# EAGLE design Single Cell (EAGLE 6.2)
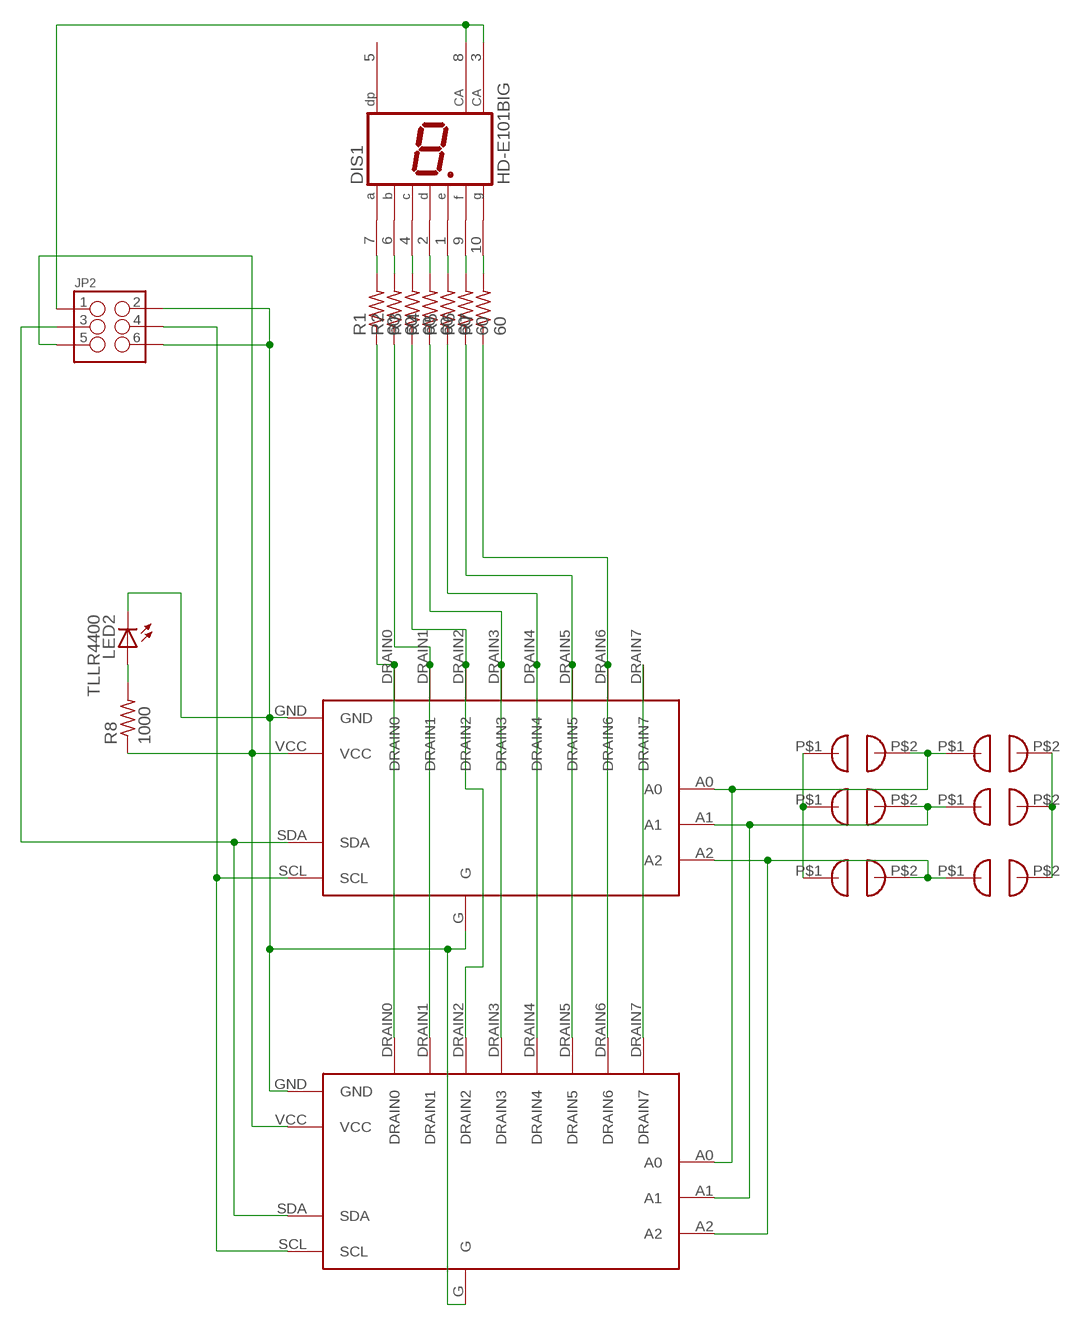
[diagram p0: schematic, sheet 1]

## Parts
DIS1  HD-E101BIG  HD-E101BACKWARDS  [7SEGMENT_BACKWARDS]
JP2  M03X2SHROUD  [2X3-SHROUDED]
LED2  TLLR4400  [LED3MM]
R1  60  R-US_0207/15  [0207/15]
R2  60  R-US_0207/15  [0207/15]
R3  60  R-US_0207/15  [0207/15]
R4  60  R-US_0207/15  [0207/15]
R5  60  R-US_0207/15  [0207/15]
R6  60  R-US_0207/15  [0207/15]
R7  60  R-US_0207/15  [0207/15]
R8  1000  R-US_0207/15  [0207/15]
U$1  SOLDER_JUMPER  [SOLDER_JUMPER]
U$2  LED_DRIVERBOARDADAFRUIT  [DRIVER_BOARD_ADAFRUIT]
U$3  SOLDER_JUMPER  [SOLDER_JUMPER]
U$4  SOLDER_JUMPER  [SOLDER_JUMPER]
U$5  SOLDER_JUMPER  [SOLDER_JUMPER]
U$6  SOLDER_JUMPER  [SOLDER_JUMPER]
U$7  SOLDER_JUMPER  [SOLDER_JUMPER]
U$8  LED_DRIVERBOARD  [DRIVER_BOARD]

## Nets
GND: JP2.2 JP2.6 LED2.K(C) U$1.P$1 U$2.G U$2.GND U$4.P$1 U$6.P$1 U$8.G U$8.GND
N$1: DIS1.7(A) R1.2
N$2: DIS1.6(B) R2.2
N$3: DIS1.4(C) R3.2
N$4: DIS1.2(D) R4.2
N$5: DIS1.1(E) R5.2
N$6: DIS1.9(F) R6.2
N$7: DIS1.10(G) R7.2
N$8: R1.1 U$2.DRAIN0 U$8.DRAIN0
N$9: R2.1 U$2.DRAIN1 U$8.DRAIN1
N$10: R3.1 U$2.DRAIN2 U$8.DRAIN2
N$11: R4.1 U$2.DRAIN3 U$8.DRAIN3
N$12: R5.1 U$2.DRAIN4 U$8.DRAIN4
N$13: R6.1 U$2.DRAIN5 U$8.DRAIN5
N$14: R7.1 U$2.DRAIN6 U$8.DRAIN6
N$15: U$2.A1 U$4.P$2 U$5.P$1 U$8.A1
N$16: U$2.A2 U$6.P$2 U$7.P$1 U$8.A2
N$17: U$2.DRAIN7 U$8.DRAIN7
N$18: LED2.A R8.2
N$29: U$1.P$2 U$2.A0 U$3.P$1 U$8.A0
SDA: JP2.3 U$2.SDA U$8.SDA
SSCL: JP2.4 U$2.SCL U$8.SCL
VCC5: JP2.5 R8.1 U$2.VCC U$3.P$2 U$5.P$2 U$7.P$2 U$8.VCC
VCC12: DIS1.3(CA) DIS1.8(CA) JP2.1
Unconnected: DIS1.5(DP)

## Library data of the parts
DIS1 = Parts:HD-E101: LED DISPLAY 1-character 7 segment, decimal point right
JP2 = Ben-SF-Con:M03X2: 2x3 .1" header. Shrouded, with keying- CONN-10681 SMT- CONN-11415 Pogo pins- HW-11044; PROD_ID: CONN-10681
LED2 = led:TLLR4400: Low Current (2mA) LED 3 mm Tinted Diffused Package color RED Source: Data sheet <http://www.farnell.com/datasheets/391100.pdf>; MF: VISHAY SEMICONDUCTOR; OC_FARNELL: 1612437
R1-R8 = Ben-rcl:R-US_: RESISTOR, American symbol
U$1 U$3-U$7 = Parts:SOLDER_JUMPER
U$2 U$8 = Parts:LED_DRIVERBOARD

## Net classes
0 default: width 0.001 mm

## Board
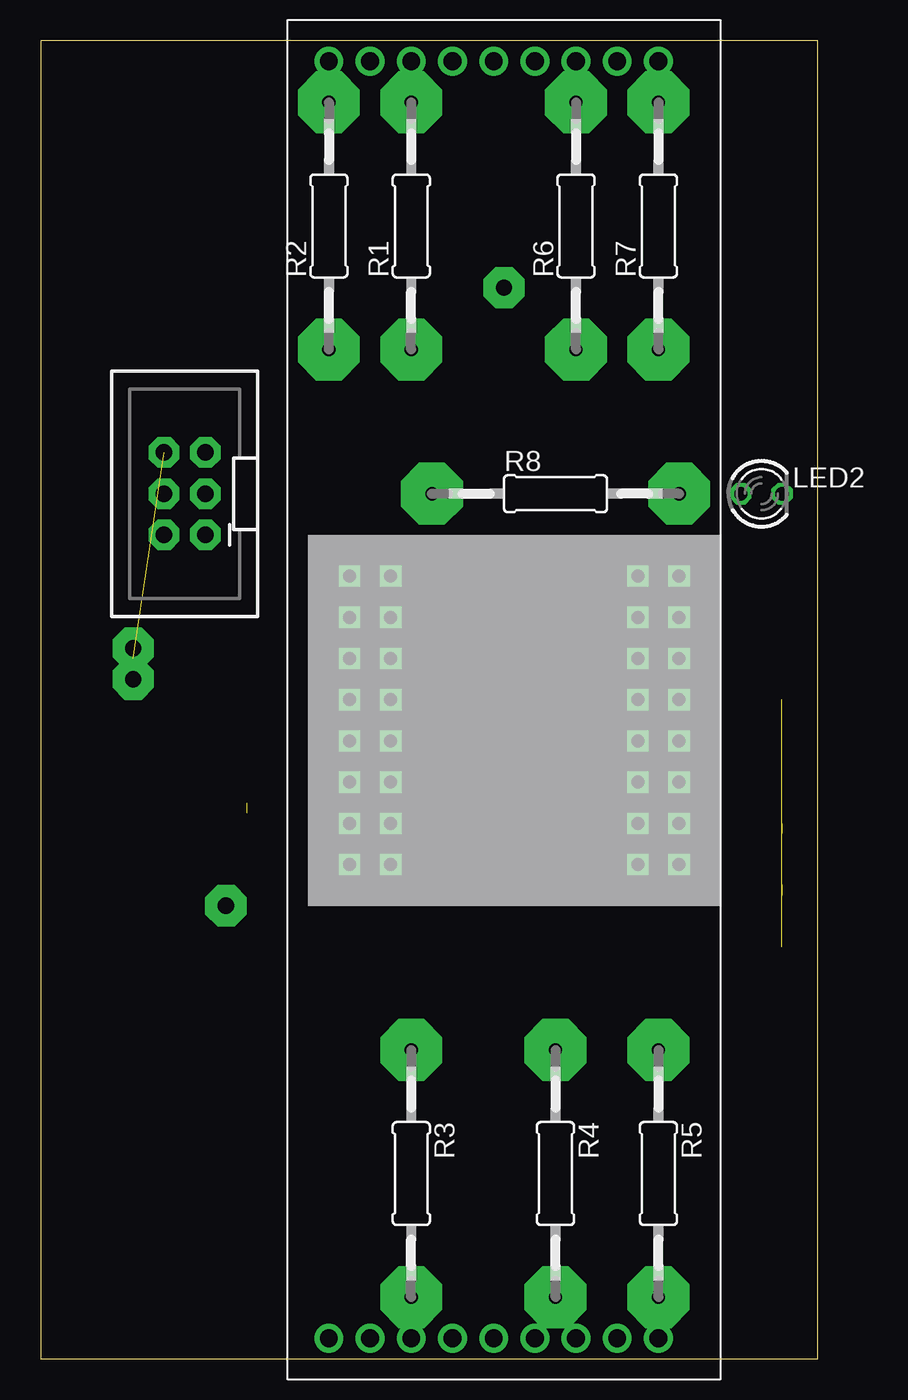
[diagram p1: board, top side]
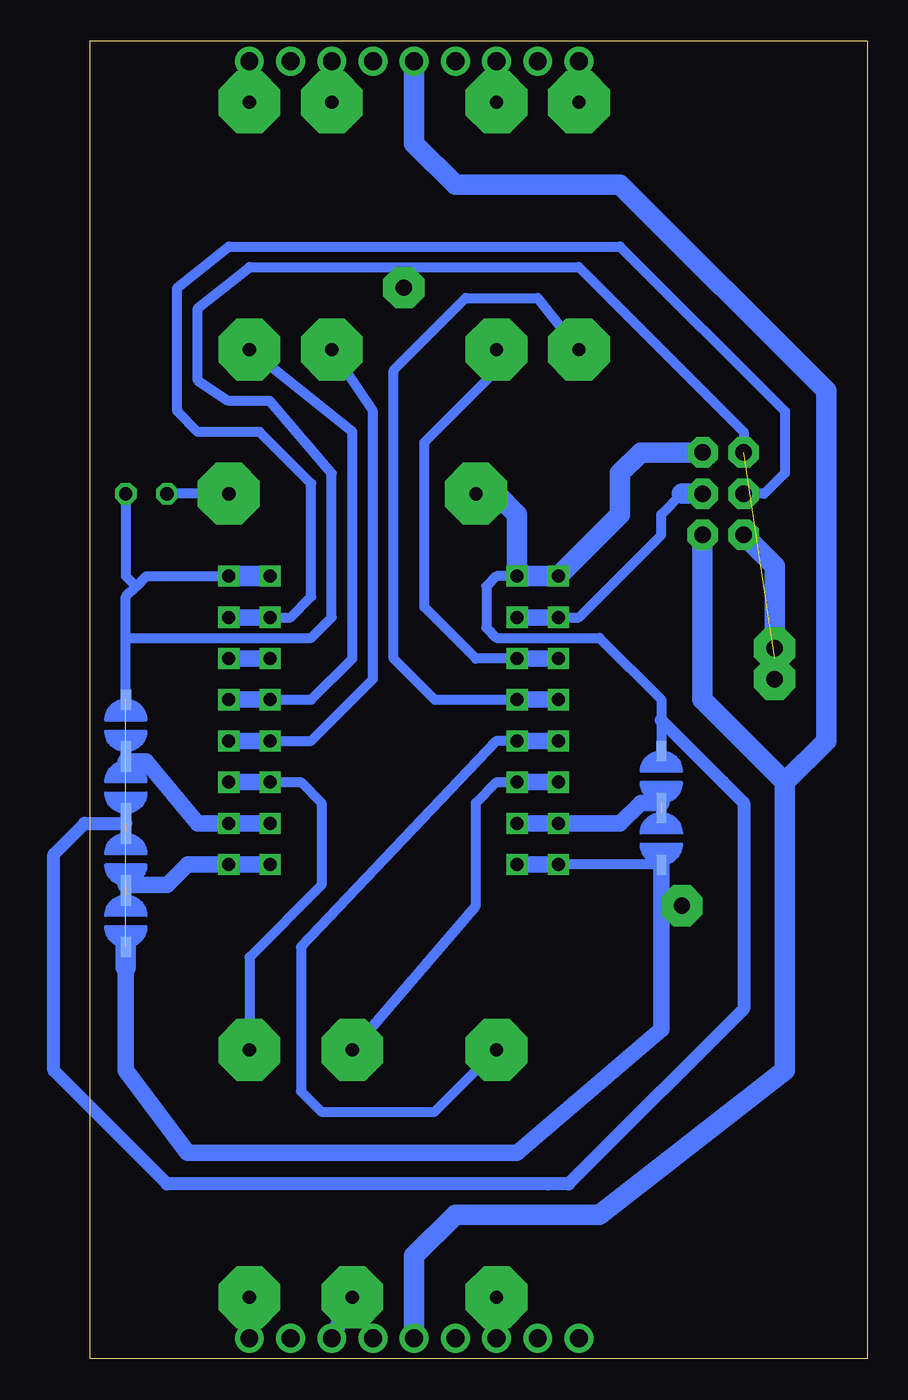
[diagram p2: board, bottom side, seen from below]

Size 47.93 x 81.27 mm. Coordinates in mm from the lower left corner, seen from the top.
Outline: 0,0 47.93,0 47.93,81.27 0,81.27 0,0
Copper layers (1*16): Top 0.035mm / dielectric 1.5mm / Bottom 0.035mm
Design rules: minimum track width 10mil, minimum drill 24mil, track to track 10mil, track to pad 10mil, pad to pad 10mil, via to via 10mil, smd to smd 10mil, copper to edge 40mil, drill to drill 8mil, minimum pad ring 10mil, minimum via ring 8mil, stop-mask expansion 4mil, vias tented up to drill 0mil, thermal gap 10mil

### Footprints (pad centres in the part's own frame; a part is rotated, then mirrored left to right if it is on the bottom)
7SEGMENT_BACKWARDS = drill 1.1 pad 1.778: 1 20.32,0; 2 15.24,0; 3 10.16,0; 4 5.08,0; 5 0,0; 6 0,78.74; 7 5.08,78.74; 8 10.16,78.74; 9 15.24,78.74; 10 20.32,78.74; GND 17.78,78.74; GND2 12.7,78.74; GND3 7.62,78.74; GND4 2.54,78.74; GND5 17.78,0; GND6 12.7,0; GND7 7.62,0; GND8 2.54,0
2X3-SHROUDED = drill 1.016 pad 1.88 octagon: 1 -1.27,2.54; 2 1.27,2.54; 3 -1.27,0; 4 1.27,0; 5 -1.27,-2.54; 6 1.27,-2.54
LED3MM = drill 0.813 octagon: A -1.27,0; K 1.27,0
0207/15 = drill 0.813 pad 3.81 octagon: 1 -7.62,0; 2 7.62,0
SOLDER_JUMPER = smd 0.635 x 1.27: P$1 0,1.27; P$2 0,-1.905
DRIVER_BOARD_ADAFRUIT = drill 0.8 square: A0 8.89,7.62; A1 6.35,7.62; A2 6.35,-7.62; DRAIN0 -3.81,-7.62; DRAIN1 -1.27,-7.62; DRAIN2 1.27,-7.62; DRAIN3 3.81,-7.62; DRAIN4 3.81,7.62; DRAIN5 1.27,7.62; DRAIN6 -1.27,7.62; DRAIN7 -3.81,7.62; G 8.89,-7.62; GND -8.89,7.62; SCL -6.35,7.62; SDA -6.35,-7.62; VCC -8.89,-7.62
DRIVER_BOARD = drill 0.8 square: A0 8.89,10.16; A1 6.35,10.16; A2 6.35,-10.16; DRAIN0 -3.81,-10.16; DRAIN1 -1.27,-10.16; DRAIN2 1.27,-10.16; DRAIN3 3.81,-10.16; DRAIN4 3.81,10.16; DRAIN5 1.27,10.16; DRAIN6 -1.27,10.16; DRAIN7 -3.81,10.16; G 8.89,-10.16; GND -8.89,10.16; SCL -6.35,10.16; SDA -6.35,-10.16; VCC -8.89,-10.16

### Placement (x,y rotation side)
DIS1  17.78,1.27 0 top
JP2  8.89,53.34 180 top
LED2  44.45,53.34 0 top
R1  22.86,69.85 90 top
R2  17.78,69.85 90 top
R3  22.86,11.43 270 top
R4  31.75,11.43 270 top
R5  38.1,11.43 270 top
R6  33.02,69.85 90 top
R7  38.1,69.85 90 top
R8  31.75,53.34 0 top
U$1  45.72,26.67 180 bottom
U$2  29.21,39.37 270 top
U$3  45.72,30.48 180 bottom
U$4  45.72,39.37 0 bottom
U$5  45.72,35.56 0 bottom
U$6  12.7,31.75 180 bottom
U$7  12.7,35.56 180 bottom
U$8  29.21,39.37 270 top

### Tracks (layer width: path | path; a pad name or v marks a point on that pad's centre or on a via)
GND  (3 unrouted)
  Bottom 0.61: U$6.P$1 | U$6.P$1 U$8.G | 45.72,44.45 45.72,46.99 | 45.72,46.99 45.09,47.63 | 45.09,47.63 44.45,48.26 U$8.GND | 45.72,46.99 | U$4.P$1 | U$4.P$1 45.72,44.45 | 45.72,44.45 34.29,44.45 33.02,45.72 33.02,54.61 36.83,59.06 39.37,59.06 41.28,60.33 41.28,64.77 38.1,67.31 17.78,67.31 7.62,57.15 JP2.6 | LED2.K | LED2.K 45.72,48.26 45.09,47.63
  Bottom 1.016: U$8.G U$2.G | 45.72,24.13 45.72,17.78 41.91,12.7 21.59,12.7 12.7,20.32 U$6.P$1 | U$1.P$1
  Bottom 1.27: U$2.GND U$8.GND | U$1.P$1 | U$1.P$1 45.72,24.13 | JP2.2 5.72,48.9 5.72,43.18
N$1
  Bottom 1.016: R1.2 DIS1.7
N$2
  Bottom 1.016: R2.2 DIS1.6
N$3
  Bottom 1.016: R3.2 DIS1.4
N$4
  Bottom 1.016: DIS1.2 | DIS1.2 R4.2
N$5
  Bottom 1.016: R5.2 DIS1.1 | DIS1.1
N$6
  Bottom 1.016: R6.2 DIS1.9 | DIS1.9
N$7
  Bottom 1.016: R7.2 DIS1.10 | DIS1.10
N$8
  Bottom 0.61: U$2.DRAIN0 | U$2.DRAIN0 24.13,43.18 27.31,46.35 27.31,56.51 22.86,60.96 R1.1
  Bottom 1.016: U$2.DRAIN0 U$8.DRAIN0
N$9
  Bottom 0.61: R2.1 20.32,65.41 24.77,65.41 29.21,60.96 29.21,43.18 26.67,40.64 U$2.DRAIN1 | U$2.DRAIN1
  Bottom 1.016: U$8.DRAIN1 U$2.DRAIN1
N$10
  Bottom 0.61: U$2.DRAIN2 | U$2.DRAIN2 22.86,38.1 34.93,25.4 34.93,16.51 33.66,15.24 26.67,15.24 R3.1
  Bottom 1.016: U$2.DRAIN2 U$8.DRAIN2
N$11
  Bottom 0.61: R4.1 24.13,27.94 24.13,34.29 22.86,35.56 U$2.DRAIN3
  Bottom 1.016: U$8.DRAIN3 U$2.DRAIN3
N$12
  Bottom 0.61: U$8.DRAIN4 | U$8.DRAIN4 34.93,35.56 33.66,34.29 33.66,29.21 38.1,24.77 R5.1
  Bottom 1.016: U$2.DRAIN4 | U$2.DRAIN4 U$8.DRAIN4 | U$8.DRAIN4 | U$8.DRAIN4
N$13
  Bottom 0.61: R6.1 30.48,58.42 30.48,41.91 31.75,40.64 34.29,38.1 | U$2.DRAIN5 34.29,38.1 | 34.29,38.1
  Bottom 1.016: U$8.DRAIN5 U$2.DRAIN5
N$14
  Bottom 0.61: U$2.DRAIN6 34.29,40.64 31.75,43.18 31.75,57.15 R7.1
  Bottom 1.016: U$2.DRAIN6 U$8.DRAIN6
N$15  (1 unrouted)
  Bottom 1.016: U$8.A1 | U$8.A1 41.28,33.02 44.45,36.83 U$5.P$1 | U$2.A1 U$8.A1
N$16  (1 unrouted)
  Bottom 1.016: U$7.P$1 13.97,34.29 15.24,33.02 U$8.A2 U$2.A2
N$17
  Bottom 1.016: U$8.DRAIN7 U$2.DRAIN7
N$18
  Bottom 0.61: R8.2 LED2.A
N$19  (via drill 1 pad 2.54)
  other vias: 5.72,41.91
N$20  (via drill 1 pad 2.54)
  other vias: 11.43,27.94
N$21  (via drill 1 pad 2.54)
  other vias: 5.72,43.81
N$22  (via drill 1 pad 2.54)
  other vias: 28.58,66.04
N$29  (1 unrouted)
  Bottom 1.016: 43.18,29.21 41.91,30.48 U$8.A0 U$2.A0 | 43.18,29.21 | 43.18,29.21 U$3.P$1
SDA
  Bottom 0.61: U$8.SDA 17.78,45.72 12.7,50.8 12.7,52.07 11.43,53.34
  Bottom 1.016: U$8.SDA U$2.SDA
  Bottom 1.27: 11.43,53.34 JP2.3
SSCL
  Bottom 0.61: U$2.SCL 35.56,45.72 34.29,46.99 34.29,53.98 37.47,57.15 40.64,57.15 41.28,57.15 42.55,58.42 42.55,66.04 39.37,68.58 15.24,68.58 5.08,58.42 5.08,54.61 6.35,53.34 JP2.4
  Bottom 1.016: U$2.SCL U$8.SCL
VCC5  (1 unrouted)
  Bottom 0.61: U$8.VCC | U$2.VCC 22.86,48.26 | 22.86,48.26 | 22.86,48.26 23.5,47.62 23.5,45.08 22.86,44.45 16.51,44.45 12.7,40.64 12.7,39.37 U$7.P$2 | U$5.P$2 45.72,33.02
  Bottom 0.813: 12.7,39.37 | 12.7,39.37 8.89,35.56 | 8.89,35.56 | 8.89,35.56 7.62,34.29 7.62,21.59 17.78,11.43 18.42,10.79 19.69,10.79 43.18,10.79 50.17,17.78 50.17,31.11 48.26,33.02 45.72,33.02
  Bottom 1.27: JP2.5 13.97,55.88 15.24,54.61 15.24,52.07 U$8.VCC U$2.VCC 21.59,52.07 22.86,53.34 R8.1
VCC12
  Bottom 1.27: JP2.1 | JP2.1 10.16,40.64 5.08,35.56 | 5.08,35.56 5.08,17.78 16.51,8.89 25.4,8.89 27.94,6.35 DIS1.3 | DIS1.8 27.94,74.93 25.4,72.39 15.24,72.39 2.54,59.69 2.54,38.1 5.08,35.56